# Altium project PICO-V1.1.PrjPcb
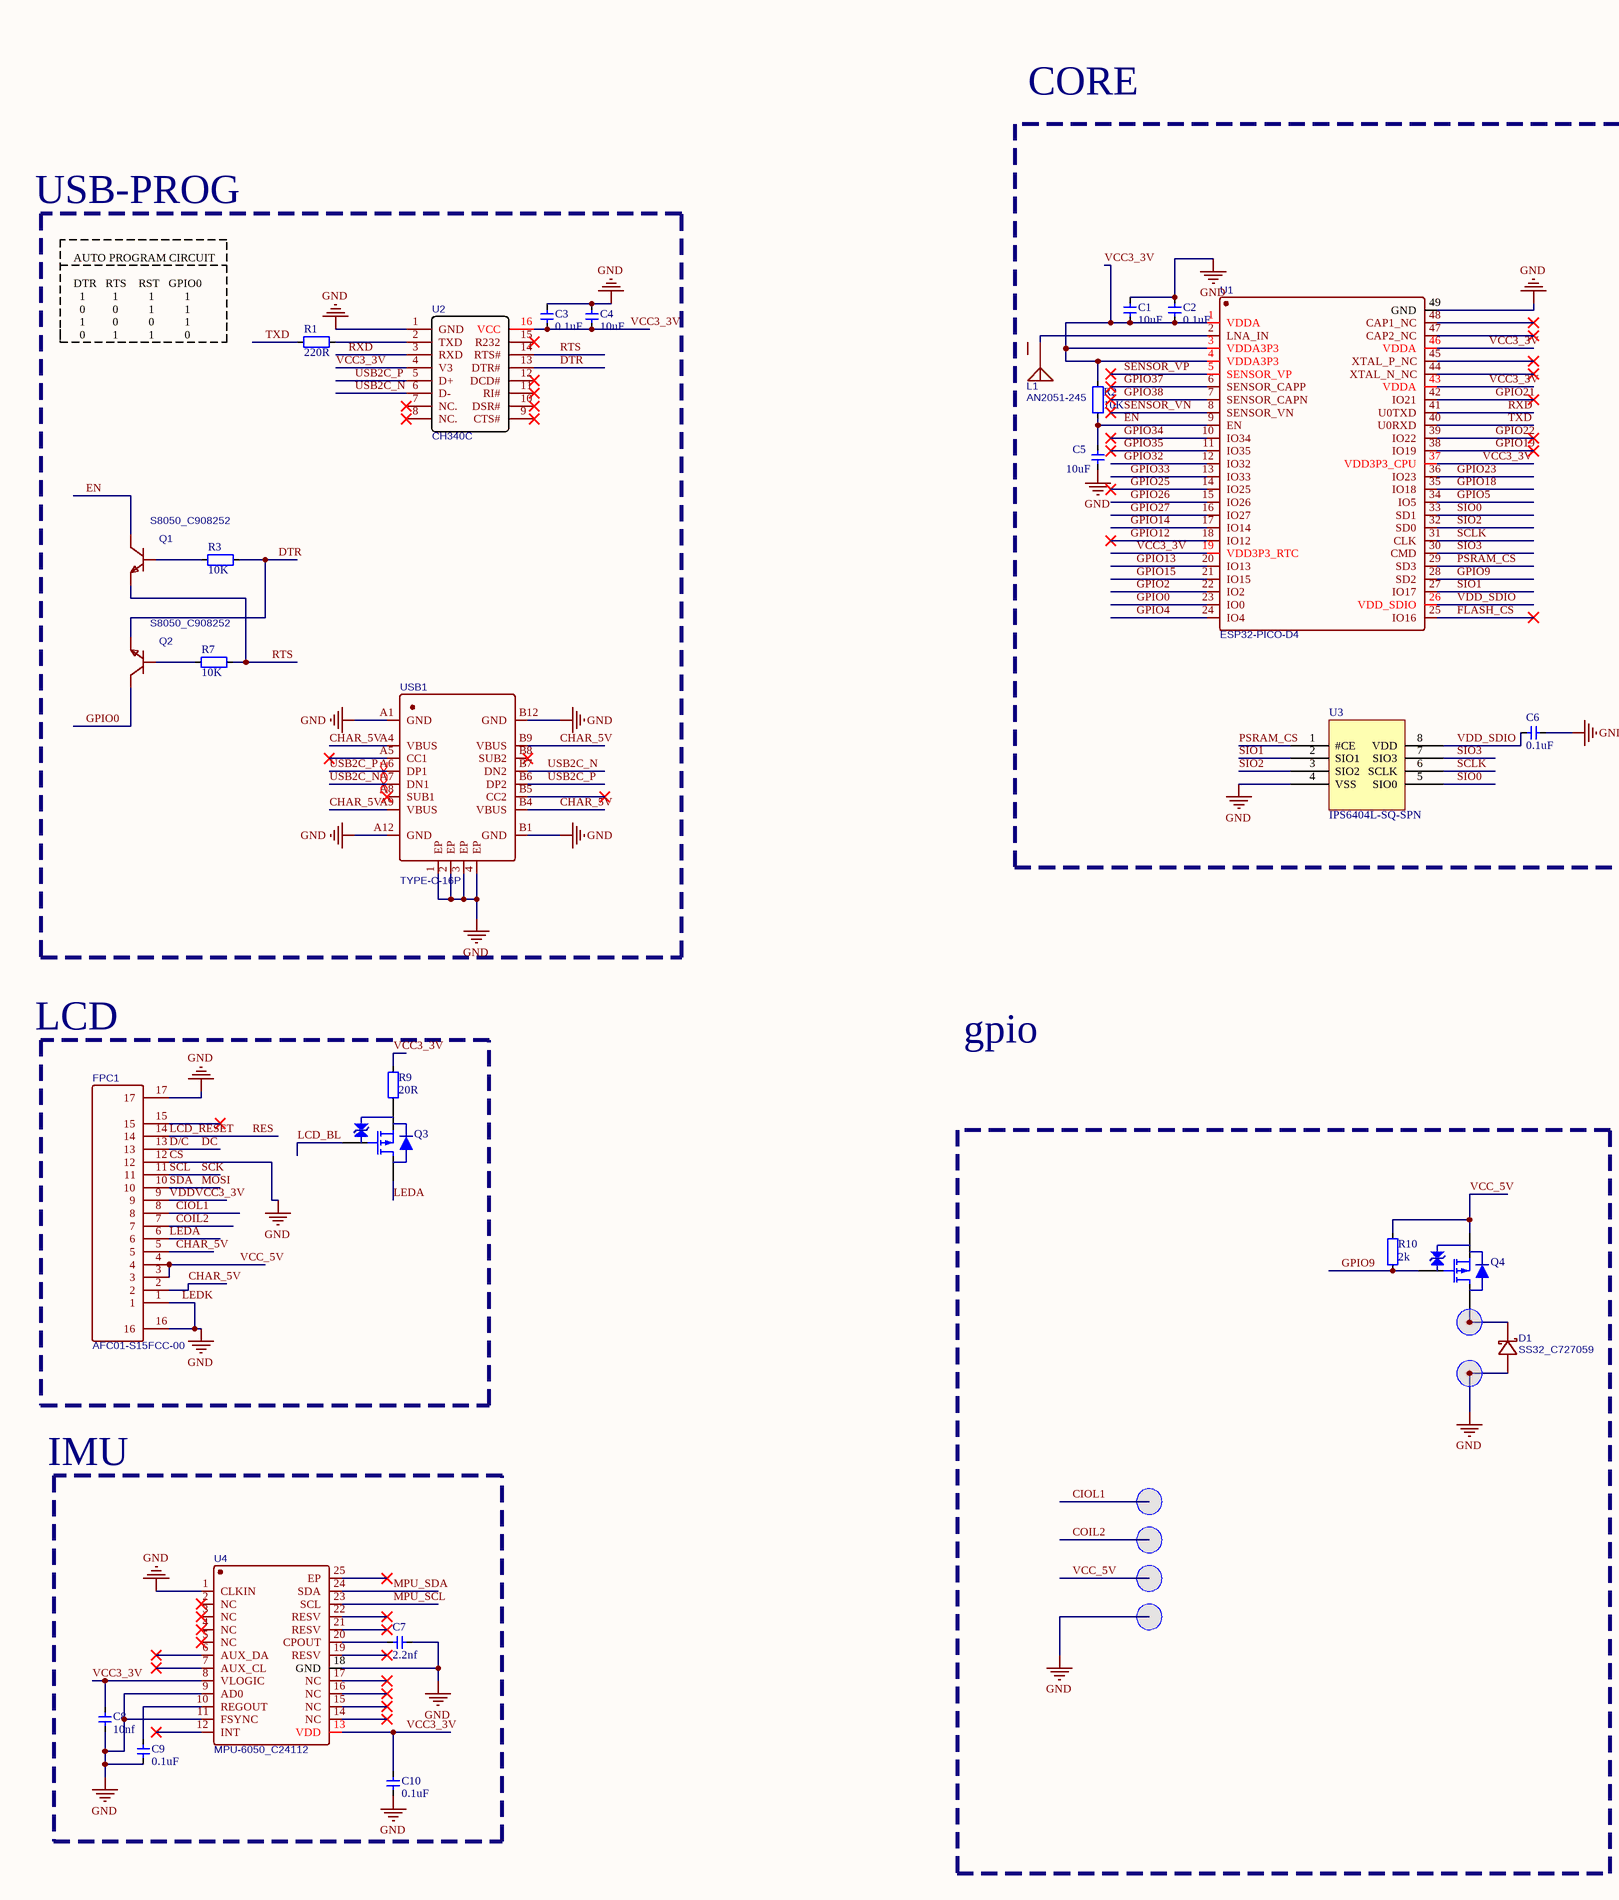
[diagram p0: Main.SchDoc, left]
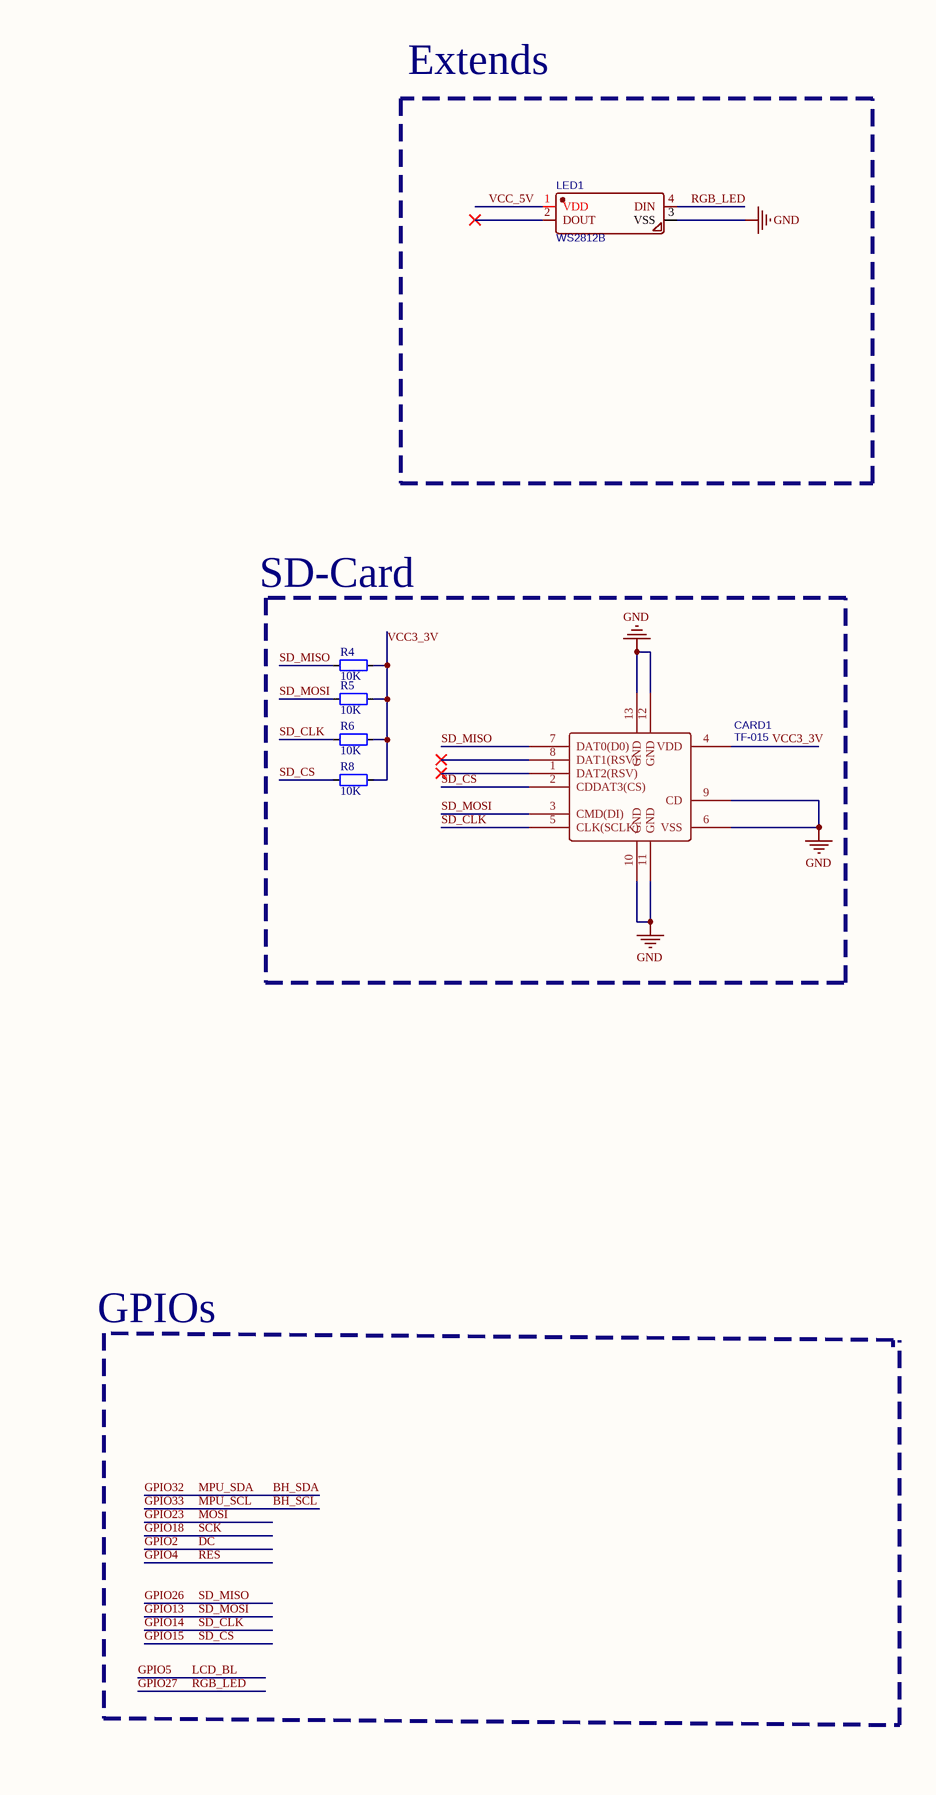
[diagram p1: Main.SchDoc, right]
1 sheet, 40 parts. Net scope: global (net labels, ports and power ports of the same name join across sheets).
Board file: PCB3.PcbDoc

## Sheet Main.SchDoc
size A2; SheetNumber: 1; SheetTotal: 1

### Parts
C1  10uF  [CAP_0402]
C2  0.1uF  [CAP_0402]
C3  0.1uF  [CAP_0402]
C4  10uF  [CAP_0402]
C5  10uF  [CAP_0402]
C6  0.1uF  [CAP_0402]
C7  2.2nf  [CAP_0402]
C8  10nf  [CAP_0402]
C9  0.1uF  [CAP_0402]
C10  0.1uF  [CAP_0402]
CARD1  TF-015  [TF-SMD_TF-015]
D1  SS32_C727059  [SMAF_L4.3-W2.5-LS5.0-RD]
FPC1  AFC01-S15FCC-00  [FPC-SMD_AFC01-S15FCC-00]
L1  AN2051-245  [ANT2051]
LED1  WS2812B  [LED-SMD_4P-L5.0-W5.0-TL]
Q1  S8050_C908252  [SOT-23-3_L2.9-W1.3-P1.90-LS2.4-BR]
Q2  S8050_C908252  [SOT-23-3_L2.9-W1.3-P1.90-LS2.4-BR]
Q3  AO3415A  [SOT23-3]  (value not drawn)
Q4  AO3415A  [SOT23-3]  (value not drawn)
R1  220R  [RES_0402]
R2  10K  [RES_0402]
R3  10K  [RES_0402]
R4  10K  [RES_0402]
R5  10K  [RES_0402]
R6  10K  [RES_0402]
R7  10K  [RES_0402]
R8  10K  [RES_0402]
R9  20R  [RES_0402]
R10  2k  [RES_0402]
T1  测试点  [TEST_PT]  (value not drawn)
T2  测试点  [TEST_PT]  (value not drawn)
T3  测试点  [TEST_PT]  (value not drawn)
T4  测试点  [TEST_PT]  (value not drawn)
T5  测试点  [TEST_PT]  (value not drawn)
T6  测试点  [TEST_PT]  (value not drawn)
U1  ESP32-PICO-D4  [QFN-48_L7.0-W7.0-P0.50-BL-EP5.1]
U2  CH340C  [SOP-16_L10.0-W3.9-P1.27-LS6.0-BL]
U3  IPS6404L-SQ-SPN  [SOIC-8_L5.0-W4.0-P1.27-LS6.0-BL-EP]
U4  MPU-6050_C24112  [QFN-24_L4.0-W4.0-P0.50-BL-EP2.6]
USB1  TYPE-C-16P  [USB-C-SMD_KH-TYPE-C-16P]

### Blocks framed on the sheet
Extends: LED1

### Nets
CS: C1.2 C2.2 C3.2 C4.2 C5.1 C6.2 C7.2 C8.2 C9.2 C10.2 CARD1.6(VSS) CARD1.9(CD) CARD1.10(GND) CARD1.11(GND) CARD1.12(GND) CARD1.13(GND) D1.2(A) FPC1.1 FPC1.12 FPC1.16 FPC1.17 LED1.3(VSS) T2.0 T6.0 U1.49(GND) U2.1(GND) U3.4(VSS) U4.1(CLKIN) U4.9(AD0) U4.11(FSYNC) U4.18(GND) USB1.1(EP) USB1.2(EP) USB1.3(EP) USB1.4(EP) USB1.A1(GND) USB1.A12(GND) USB1.B1(GND) USB1.B12(GND)  [also labelled GND, LEDK]
BH_SCL: U1.13(IO33) U4.23(SCL)  [also labelled GPIO33, MPU_SCL]
BH_SDA: U1.12(IO32) U4.24(SDA)  [also labelled GPIO32, MPU_SDA]
CHAR_5V: FPC1.2 FPC1.5 USB1.A4(VBUS) USB1.A9(VBUS) USB1.B4(VBUS) USB1.B9(VBUS)
CIOL1: FPC1.8 T3.0
COIL2: FPC1.7 T4.0
D/C: FPC1.13 U1.22(IO2)  [also labelled DC, GPIO2]
DTR: Q2.2(E) R3.1 U2.13(DTR#)
EN: C5.2 Q1.3(C) R2.1 U1.9(EN)
FLASH_CS: U1.25(IO16)
GPIO0: Q2.3(C) U1.23(IO0)
GPIO4: FPC1.14 U1.24(IO4)  [also labelled LCD_RESET, RES]
GPIO5: Q3.1(G) U1.34(IO5)  [also labelled LCD_BL]
GPIO9: Q4.1(G) R10.1 U1.28(SD2)
GPIO12: U1.18(IO12)
GPIO13: CARD1.3(CMD(DI)) R5.1 U1.20(IO13)  [also labelled SD_MOSI]
GPIO14: CARD1.5(CLK(SCLK)) R6.1 U1.17(IO14)  [also labelled SD_CLK]
GPIO15: CARD1.2(CDDAT3(CS)) R8.1 U1.21(IO15)  [also labelled SD_CS]
GPIO18: FPC1.11 U1.35(IO18)  [also labelled SCK, SCL]
GPIO19: U1.38(IO19)
GPIO21: U1.42(IO21)
GPIO22: U1.39(IO22)
GPIO23: FPC1.10 U1.36(IO23)  [also labelled MOSI, SDA]
GPIO25: U1.14(IO25)
GPIO26: CARD1.7(DAT0(D0)) R4.1 U1.15(IO26)  [also labelled SD_MISO]
GPIO27: LED1.4(DIN) U1.16(IO27)  [also labelled RGB_LED]
GPIO34: U1.10(IO34)
GPIO35: U1.11(IO35)
GPIO37: U1.6(SENSOR_CAPP)
GPIO38: U1.7(SENSOR_CAPN)
LEDA: FPC1.6 Q3.3(D)
PSRAM_CS: U1.29(SD3) U3.1(#CE)
RTS: Q1.2(E) R7.1 U2.14(RTS#)
RXD: U1.41(U0TXD) U2.3(RXD)
SCLK: U1.31(CLK) U3.6(SCLK)
SENSOR_VN: U1.8(SENSOR_VN)
SENSOR_VP: U1.5(SENSOR_VP)
SIO0: U1.33(SD1) U3.5(SIO0)
SIO1: U1.27(IO17) U3.2(SIO1)
SIO2: U1.32(SD0) U3.3(SIO2)
SIO3: U1.30(CMD) U3.7(SIO3)
TXD: R1.2 U1.40(U0RXD)
USB2C_N: U2.6(D-) USB1.A7(DN1) USB1.B7(DN2)
USB2C_P: U2.5(D+) USB1.A6(DP1) USB1.B6(DP2)
VCC3_3V: C1.1 C2.1 C3.1 C4.1 C8.1 C10.1 CARD1.4(VDD) FPC1.9 R2.2 R4.2 R5.2 R6.2 R8.2 R9.2 U1.1(VDDA) U1.3(VDDA3P3) U1.4(VDDA3P3) U1.19(VDD3P3_RTC) U1.37(VDD3P3_CPU) U1.43(VDDA) U1.46(VDDA) U2.4(V3) U2.16(VCC) U4.8(VLOGIC) U4.13(VDD)  [also labelled VDD]
VCC_5V: FPC1.3 FPC1.4 LED1.1(VDD) Q4.2(S) R10.2 T5.0
VDD_SDIO: C6.1 U1.26(VDD_SDIO) U3.8(VDD)
NetC7_1: C7.1 U4.20(CPOUT)
NetC9_1: C9.1 U4.10(REGOUT)
NetD1_1: D1.1(C) Q4.3(D) T1.0
NetL1_1: L1.1(ANT) U1.2(LNA_IN)
NetQ1_1: Q1.1(B) R3.2
NetQ2_1: Q2.1(B) R7.2
NetQ3_2: Q3.2(S) R9.1
NetR1_1: R1.1 U2.2(TXD)

Not connected (* = marked no-connect by the designer): CARD1 1(DAT2(RSV))* 8(DAT1(RSV))*; FPC1 15*; L1 2; LED1 2(DOUT)*; U1 44(XTAL_N_NC)* 45(XTAL_P_NC)* 47(CAP2_NC)* 48(CAP1_NC)*; U2 7(NC.)* 8(NC.)* 9(CTS#)* 10(DSR#)* 11(RI#)* 12(DCD#)* 15(R232)*; U4 2(NC)* 3(NC)* 4(NC)* 5(NC)* 6(AUX_DA)* 7(AUX_CL)* 12(INT)* 14(NC)* 15(NC)* 16(NC)* 17(NC)* 19(RESV)* 21(RESV)* 22(RESV)* 25(EP)*; USB1 A5(CC1)* A8(SUB1)* B5(CC2)* B8(SUB2)*

### Layout directives
differential pair: USB2C_N, USB2C_P

### Notes on the sheet
- CORE
- USB-PROG
- AUTO PROGRAM CIRCUIT
  DTR   RTS    RST   GPIO0
  1         1          1          1
  0         0          1          1
  1         0          0          1
  0         1          1          0
- SD-Card
- LCD
- gpio
- GPIOs
- IMU

### Library data of the parts
C1-C10 = 电容-0402: Capacitor; Value: 0.1u
CARD1 = TF卡座-015: BOM_Manufacturer: SOFNG; BOM_Supplier: LCSC; BOM_Manufacturer Part: TF-015; BOM_Supplier Part: C113206; BOM_JLCPCB Part Class: Extended Part; spicePre: C; spiceSymbolName: TF-015
D1 = SS32_C727059: BOM_Manufacturer: TWGMC; BOM_Manufacturer Part: SS32; Contributor: LCSC; BOM_Supplier: LCSC; BOM_Supplier Part: C727059; BOM_JLCPCB Part Class: Extended Part; spicePre: D; spiceSymbolName: SS32_C727059
FPC1 = FPC-15P-0.5-AFC01-S15FCC-00: BOM_Manufacturer: JUSHUO; Contributor: LCSC; BOM_Supplier: LCSC; BOM_Supplier Part: C262271; BOM_Manufacturer Part: AFC01-S15FCC-00; BOM_JLCPCB Part Class: Extended Part; spicePre: F; spiceSymbolName: AFC01-S15FCC-00
L1 = WIFI天线-AN2051-245: BOM_Manufacturer: Rainsun; BOM_Supplier: LCSC; BOM_Manufacturer Part: AN2051-245; BOM_Supplier Part: C99727; BOM_JLCPCB Part Class: Extended Part; spicePre: L; spiceSymbolName: AN2051-245
LED1 = WS2812B: RGB灯单线控制; BOM_Manufacturer: Worldsemi; Contributor: LCSC; BOM_Supplier: LCSC; BOM_Manufacturer Part: WS2812B; BOM_Supplier Part: C114585; BOM_JLCPCB Part Class: Extended Part; spicePre: L; spiceSymbolName: WS2812B
Q1 Q2 = 三极管-贴片-S8050_C908252: BOM_Manufacturer: FUXINSEMI; BOM_Manufacturer Part: S8050; Contributor: LCSC; BOM_Supplier: LCSC; BOM_Supplier Part: C908252; BOM_JLCPCB Part Class: Extended Part; spicePre: Q; spiceSymbolName: S8050_C908252
Q3 Q4 = MOS管-P-AO3415A: MOSFET; Published: 8-Jun-2000; LatestRevisionDate: 17-Jul-2002; LatestRevisionNote: Re-released for DXP Platform.; PackageVersion: 1995/1996; PackageReference: E3; Publisher: Altium Limited; PackageDescription: TO, Flat Index; 3 In-Line, Axial Leads; Body Dia. 4.6mm; Lead Dia. 0.5 mm (max)
R1-R10 = 电阻-0402: Resistor; Value: 22R
U1 = ESP32-PICO-D4: BOM_Manufacturer: Espressif Systems; Contributor: LCSC; BOM_Supplier: LCSC; BOM_Supplier Part: C193707; BOM_Manufacturer Part: ESP32-PICO-D4; BOM_JLCPCB Part Class: Extended Part; spicePre: U; spiceSymbolName: ESP32-PICO-D4
U2 = CH340C: BOM_Manufacturer: WCH; BOM_Paste Type: Extended Part; BOM_Supplier: LCSC; BOM_Manufacturer Part: CH340C; BOM_Supplier Part: C84681; BOM_JLCPCB Part Class: Extended Part; spicePre: U; spiceSymbolName: CH340C
U3 = IPS6404L-SQ-SPN: psram 8m
U4 = MPU-6050_C24112: BOM_Manufacturer: InvenSense; sourceId: 1T5FDZYC8; timeStamp: 1462265206; BOM_Supplier: LCSC; BOM_Manufacturer Part: MPU-6050; BOM_Supplier Part: C24112; BOM_JLCPCB Part Class: Basic Part; spicePre: U; spiceSymbolName: MPU-6050_C24112
USB1 = USBC母座-16P: BOM_Manufacturer: Shenzhen Kinghelm Elec; BOM_Manufacturer Part: KH-TYPE-C-16P; Contributor: LCSC; BOM_Paste Type: Extended Part; BOM_Supplier: LCSC; BOM_Supplier Part: C709357; BOM_JLCPCB Part Class: Extended Part; spicePre: U; spiceSymbolName: KH-TYPE-C-16P